# Altium schematic sheet DAC.SchDoc
size A4; DocumentNumber: 1; SheetNumber: 1; SheetTotal: 3
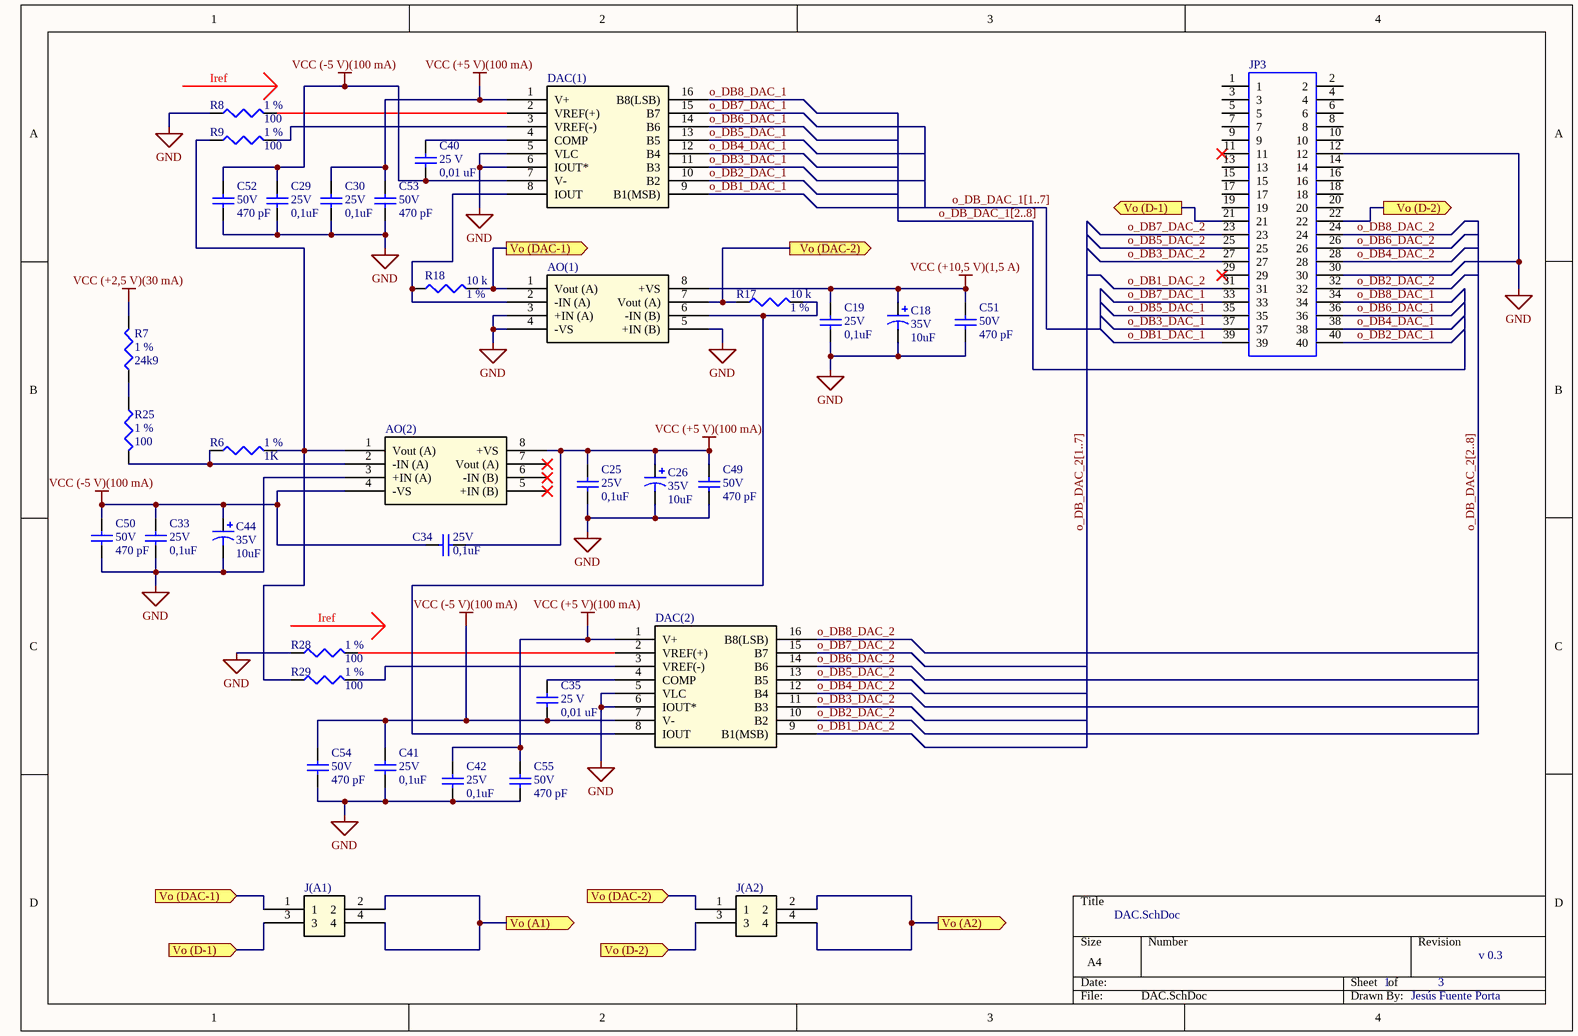
[diagram p0: DAC.SchDoc]

## Parts
AO(1)  Part Number: AD8028ARZ  [AD8028ARZ - (R_8-M)]  (value not drawn)
AO(2)  Part Number: AD8028ARZ  [AD8028ARZ - (R_8-M)]  (value not drawn)
C18  35V  value 10uF  [EEE1VA100WR]
C19  25V  value 0,1uF  [1206 [Métrica 3216]]
C25  25V  value 0,1uF  [1206 [Métrica 3216]]
C26  35V  value 10uF  [EEE1VA100WR]
C29  25V  value 0,1uF  [1206 [Métrica 3216]]
C30  25V  value 0,1uF  [1206 [Métrica 3216]]
C33  25V  value 0,1uF  [1206 [Métrica 3216]]
C34  25V  value 0,1uF  [1206 [Métrica 3216]]
C35  25 V  value 0,01 uF  [1206 [Métrica 3216]]
C40  25 V  value 0,01 uF  [1206 [Métrica 3216]]
C41  25V  value 0,1uF  [1206 [Métrica 3216]]
C42  25V  value 0,1uF  [1206 [Métrica 3216]]
C44  35V  value 10uF  [EEE1VA100WR]
C49  50V  value 470 pF  [1206 [Métrica 3216]]
C50  50V  value 470 pF  [1206 [Métrica 3216]]
C51  50V  value 470 pF  [1206 [Métrica 3216]]
C52  50V  value 470 pF  [1206 [Métrica 3216]]
C53  50V  value 470 pF  [1206 [Métrica 3216]]
C54  50V  value 470 pF  [1206 [Métrica 3216]]
C55  50V  value 470 pF  [1206 [Métrica 3216]]
DAC(1)  Part Number: DAC08ESZ  [DAC08ESZ_(R_16-M)]  (value not drawn)
DAC(2)  Part Number: DAC08ESZ  [DAC08ESZ_(R_16-M)]  (value not drawn)
J(A1)  TMM-102-01-G-D00 (2 connectors)  [TMM-102-01-G-D00 (2 connectors)]  (value not drawn)
J(A2)  TMM-102-01-G-D00 (2 connectors)  [TMM-102-01-G-D00 (2 connectors)]  (value not drawn)
JP3  IDC Connector_40p  [IDC Connector - 40 pins]  (value not drawn)
R6  1 %  value 1K  [1206 [Métrica 3216]]
R7  1 %  value 24k9  [1206 [Métrica 3216]]
R8  1 %  value 100  [1206 [Métrica 3216]]
R9  1 %  value 100  [1206 [Métrica 3216]]
R17  1 %  value 10 k  [1206 [Métrica 3216]]
R18  1 %  value 10 k  [1206 [Métrica 3216]]
R25  1 %  value 100  [1206 [Métrica 3216]]
R28  1 %  value 100  [1206 [Métrica 3216]]
R29  1 %  value 100  [1206 [Métrica 3216]]

## Ports
Vo (A1) (out), Vo (A2) (out), Vo (D-1) (in), Vo (D-1) (out), Vo (D-2) (in), Vo (D-2) (out), Vo (DAC-1) (in), Vo (DAC-1) (out), Vo (DAC-2) (in), Vo (DAC-2) (out)

## Nets
GND: AO(1).3(+IN_(A)) AO(1).4(-VS) AO(1).5(+IN_(B)) AO(2).3(+IN_(A)) C18.2 C19.1 C25.1 C26.2 C29.1 C30.1 C33.1 C41.1 C42.1 C44.2 C49.1 C50.1 C51.1 C52.1 C53.1 C54.1 C55.1 DAC(1).5(VLC) DAC(1).6(IOUT*) DAC(2).5(VLC) DAC(2).6(IOUT*) JP3.12 JP3.30 R8.1 R28.1
VCC (+2,5 V)(30 mA): R7.2
VCC (+5 V)(100 mA): AO(2).8(+VS) C25.2 C26.1 C30.2 C34.1 C42.2 C49.2 C53.2 C55.2 DAC(1).1(V+) DAC(2).1(V+)
VCC (+10,5 V)(1,5 A): AO(1).8(+VS) C18.1 C19.2 C51.2
VCC (-5 V)(100 mA): AO(2).4(-VS) C29.2 C33.2 C34.2 C35.1 C40.1 C41.2 C44.1 C50.2 C52.2 C54.2 DAC(1).7(V-) DAC(2).7(V-)
o_DB1_DAC_1: DAC(1).9(B1(MSB)) JP3.39
o_DB1_DAC_2: DAC(2).9(B1(MSB)) JP3.31
o_DB2_DAC_1: DAC(1).10(B2) JP3.40
o_DB2_DAC_2: DAC(2).10(B2) JP3.32
o_DB3_DAC_1: DAC(1).11(B3) JP3.37
o_DB3_DAC_2: DAC(2).11(B3) JP3.27
o_DB4_DAC_1: DAC(1).12(B4) JP3.38
o_DB4_DAC_2: DAC(2).12(B4) JP3.28
o_DB5_DAC_1: DAC(1).13(B5) JP3.35
o_DB5_DAC_2: DAC(2).13(B5) JP3.25
o_DB6_DAC_1: DAC(1).14(B6) JP3.36
o_DB6_DAC_2: DAC(2).14(B6) JP3.26
o_DB7_DAC_1: DAC(1).15(B7) JP3.33
o_DB7_DAC_2: DAC(2).15(B7) JP3.23
o_DB8_DAC_1: DAC(1).16(B8(LSB)) JP3.34
o_DB8_DAC_2: DAC(2).16(B8(LSB)) JP3.24
Vo (A1): J(A1).2 J(A1).4 ; port Vo (A1)
Vo (A2): J(A2).2 J(A2).4 ; port Vo (A2)
Vo (D-1): J(A1).3 JP3.21 ; port Vo (D-1)
Vo (D-2): J(A2).3 JP3.22 ; port Vo (D-2)
Vo (DAC-1): AO(1).1(Vout_(A)) J(A1).1 R18.2 ; port Vo (DAC-1)
Vo (DAC-2): AO(1).7(Vout_(A)) J(A2).1 R17.1 ; port Vo (DAC-2)
NetAO(1)_2: AO(1).2(-IN_(A)) DAC(1).8(IOUT) R18.1
NetAO(1)_6: AO(1).6(-IN_(B)) DAC(2).8(IOUT) R17.2
NetAO(2)_1: AO(2).1(Vout_(A)) R6.2 R9.1 R29.1
NetAO(2)_2: AO(2).2(-IN_(A)) R6.1 R25.2
NetC35_2: C35.2 DAC(2).4(COMP)
NetC40_2: C40.2 DAC(1).4(COMP)
NetDAC(1)_2: DAC(1).2(VREF(+)) R8.2
NetDAC(1)_3: DAC(1).3(VREF(-)) R9.2
NetDAC(2)_2: DAC(2).2(VREF(+)) R28.2
NetDAC(2)_3: DAC(2).3(VREF(-)) R29.2
NetR7_1: R7.1 R25.1

Not connected (* = marked no-connect by the designer): AO(2) 5(+IN_(B))* 6(-IN_(B))* 7(Vout_(A))*; JP3 1 2 3 4 5 6 7 8 9 10 11* 13 14 15 16 17 18 19 20 29*

## Buses and harness runs
bus o_DB_DAC_1[1..7]
bus o_DB_DAC_1[2..8]
bus o_DB_DAC_2[1..7]
bus o_DB_DAC_2[2..8]

## Notes on the sheet
- (near R8) Iref
- (near R8) Vref- = -0,1 V
  Iref = 1 mA
- I_out <= 20 mA
  Si ens passem d'aquest valor la tensió de sortida cau degut a una limitació en potència.
- (near JP3) IDC connector for DAC Digital Input signals.
- (near AO(2)) Vout = -0,1 V
- (near R28) Iref
- (near R28) Vref- = -0,1 V
  Iref = 1 mA
- (near J(A1)) Jumpers to choose between DAC or direct FPGA/Microcontroller output to activate Mosfets Drivers.
- (near J(A2)) Jumpers to choose between DAC or direct FPGA/Microcontroller output to activate Mosfets Drivers.
- v 0.3
- Jesús Fuente Porta

## Library data of the parts
AO(1) AO(2) = AD8028ARZ: AD8028ARZ -  Amplificador Operacional, Doble, 2 Amplificadores, 190 MHz, 100 V/µs, 2.7V a 12V, SOIC, 8 Pines; Vendor: Analog Devices Inc; Built_By: EMA_UL_Team; Manufacturer_Part_Number: AD8028ARZ; Copyright: Copyright (C) 2018 Accelerated Designs. All rights reserved; RefDes: RefDes; Type: DEV; Value: Value
  AO(1): ComponentLink1Description: Farnell Webpage; ComponentLink1URL: https://es.farnell.com/analog-devices/ad8028arz/amp-de-baja-distorsi-n-rri-o-smd/dp/1581947?ost=AD8028ARZ&ddkey=https%3Aes-ES%2FElement14_Spain%2Fsearch
C18 C26 C44 = Cap Pol3: EEE1VA100WR -  Condensador Electrolítico Aluminio SMD, Radial - SMD, 10 µF, 35 V, S Series, 1000 horas a 85°C; Published: 8-Jun-2000; LatestRevisionDate: 29-May-2009; LatestRevisionNote: IPC-7351 Footprint Added.; PackageReference: C0805; Publisher: Altium Limited; PackageDescription: Chip Capacitor; ComponentLink1Description: Farnell; ComponentLink1URL: https://es.farnell.com/panasonic/eee1va100wr/conden-10-f-35v-smd/dp/2808004?st=EEE1VA100WR
C19 C25 C29 C30 C33 C34 C41 C42 = Cap Semi: VJ1206Y104KXXCW1BC -  Condensador de Cerámica Multicapa, 0.1 µF, 25 V, 1206 [Métrica 3216], ± 10%, X7R, VJ Series; Published: 8-Jun-2000; LatestRevisionDate: 29-May-2009; LatestRevisionNote: IPC-7351 Footprint Added.; PackageReference: C1206; Publisher: Altium Limited; PackageDescription: Chip Capacitor; ComponentLink1Description: Farnell; ComponentLink1URL: https://es.farnell.com/vishay/vj1206y104kxxcw1bc/conden-0-1-f-25v-10-x7r-1206/dp/2896645
C35 C40 = Cap Semi: MCSH31B103K250CT -  Condensador de Cerámica Multicapa, 10000 pF, 25 V, 1206 [Métrica 3216], ± 10%, X7R, Serie MCSH; Published: 8-Jun-2000; LatestRevisionDate: 29-May-2009; LatestRevisionNote: IPC-7351 Footprint Added.; PackageReference: C1206; Publisher: Altium Limited; PackageDescription: Chip Capacitor; ComponentLink1Description: Farnell Webpage; ComponentLink1URL: https://es.farnell.com/multicomp/mcsh31b103k250ct/conden-0-01-f-25v-10-x7r-1206/dp/1856586
C49-C55 = Cap Semi: VJ1206A471JXACW1BC -  Condensador de Cerámica Multicapa, 470 pF, 50 V, 1206 [Métrica 3216], ± 5%, C0G / NP0, VJ Series; Published: 8-Jun-2000; LatestRevisionDate: 29-May-2009; LatestRevisionNote: IPC-7351 Footprint Added.; PackageReference: C1206; Publisher: Altium Limited; PackageDescription: Chip Capacitor; ComponentLink1Description: Farnell; ComponentLink1URL: https://es.farnell.com/vishay/vj1206a471jxacw1bc/conden-470pf-50v-5-c0g-np0-1206/dp/2896616
DAC(1) DAC(2) = DAC08ESZ: DAC08ESZ -  Convertidor de Señal Digital a Analógica, 8 bit, ± 4.5V a ± 18V, NSOIC, 16 Pines; Vendor: Analog Devices Inc; Built_By: EMA_UL_Team; Manufacturer_Part_Number: DAC08ESZ; Copyright: Copyright (C) 2018 Accelerated Designs. All rights reserved; RefDes: RefDes; Type: DEV; Value: Value; ComponentLink1Description: Farnell Webpage; ComponentLink1URL: https://es.farnell.com/analog-devices/dac08esz/conv-dac-8-bits-nsoic-16/dp/2462586?ost=DAC08ESZ&ddkey=https%3Aes-ES%2FElement14_Spain%2Fsearch
J(A1) J(A2) = TMM-102-01-G-D00 (2 connectors): TMM-102-01-L-D-SM -  Conector de Placa a Placa, 2 mm, 4 Contactos, Header, TMM Series, Montaje Superficial, 2 Filas; Vendor: Samtec Inc; Built_By: EMA_UL_Team; Manufacturer_Part_Number: TMM-102-01-L-D-SM; Copyright: Copyright (C) 2018 Accelerated Designs. All rights reserved; RefDes: RefDes; Type: DEV; Value: Value; ComponentLink1Description: Farnell WebPage; ComponentLink1URL: https://es.farnell.com/samtec/tmm-102-01-l-d-sm/conector-macho-4pos-2fila-2mm/dp/2856897?scope=partnumberlookahead&ost=TMM-102-01-L-D-SM&searchref=searchlookahead&exaMfpn=true&ddkey=https%3Aes-ES%2FElement14_Spain%2Fw%2Fsearch
JP3 = IDC Connector_40p: MC-254-40-00-ST-DIP -  Conector de Cable a Placa, 2.54 mm, 40 Contactos, Header, Agujero Pasante, 2 Filas; Manufacturer_Name: RS Components; Manufacturer_Part_Number: 6257296; Geometry.Height: 8.9mm; RS Part Number: 6257296; Datasheet Link: https://componentsearchengine.com/Datasheets/3/6257296.pdf; ComponentLink1Description: Farnell Webpage; ComponentLink1URL: https://es.farnell.com/multicomp/mc-254-40-00-st-dip/conector-macho-40pos-2fila-2-54mm/dp/2843536
R6 = Res3: MCWR12X1001FTL -  Resistencia SMD de Tipo Chip, Película Gruesa, 1206 [Métrica 3216], 1 kohm, Serie MCWR, 200 V; Published: 8-Jun-2000; LatestRevisionDate: 29-May-2009; LatestRevisionNote: IPC-7351 Footprint Added.; PackageReference: J1-0603; Publisher: Altium Limited; PackageDescription: Chip Resistor; ComponentLink1Description: Farnell Webpage; ComponentLink1URL: https://es.farnell.com/multicomp/mcwr12x1001ftl/res-1k-1-0-25w-1206-pel-c-gruesa/dp/2447473
R7 = Res3: MCWR12X2492FTL -  Resistencia SMD de Tipo Chip, 1206 [Métrica 3216], 24.9 kohm, MCWR12 Series, 200 V, Película Gruesa; Published: 8-Jun-2000; LatestRevisionDate: 29-May-2009; LatestRevisionNote: IPC-7351 Footprint Added.; PackageReference: J1-0603; Publisher: Altium Limited; PackageDescription: Chip Resistor; ComponentLink1Description: Farnell Webpage; ComponentLink1URL: https://es.farnell.com/multicomp/mcwr12x2492ftl/res-24k9-1-0-25w-1206-pel-c-gruesa/dp/2695140
R8 R9 R25 R28 R29 = Res3: MCWR12X1000FTL -  Resistencia SMD de Tipo Chip, Película Gruesa, 1206 [Métrica 3216], 100 ohm, Serie MCWR, 200 V; Published: 8-Jun-2000; LatestRevisionDate: 29-May-2009; LatestRevisionNote: IPC-7351 Footprint Added.; PackageReference: J1-0603; Publisher: Altium Limited; PackageDescription: Chip Resistor; ComponentLink1Description: Farnell Webpage; ComponentLink1URL: https://es.farnell.com/multicomp/mcwr12x1000ftl/res-100r-1-0-25w-pel-c-gruesa/dp/2447454
R17 R18 = Res3: CRGCQ1206F10K -  Resistencia SMD de Tipo Chip, 1206 [Métrica 3216], 10 kohm, CRGCQ Series, 200 V, Película Gruesa; Published: 8-Jun-2000; LatestRevisionDate: 29-May-2009; LatestRevisionNote: IPC-7351 Footprint Added.; PackageReference: J1-0603; Publisher: Altium Limited; PackageDescription: Chip Resistor; ComponentLink1Description: Farnell Webpage; ComponentLink1URL: https://es.farnell.com/te-connectivity/crgcq1206f10k/res-10k-1-1206-pel-c-gruesa/dp/2861595